# EAGLE design sensor_003 (EAGLE 4.16)
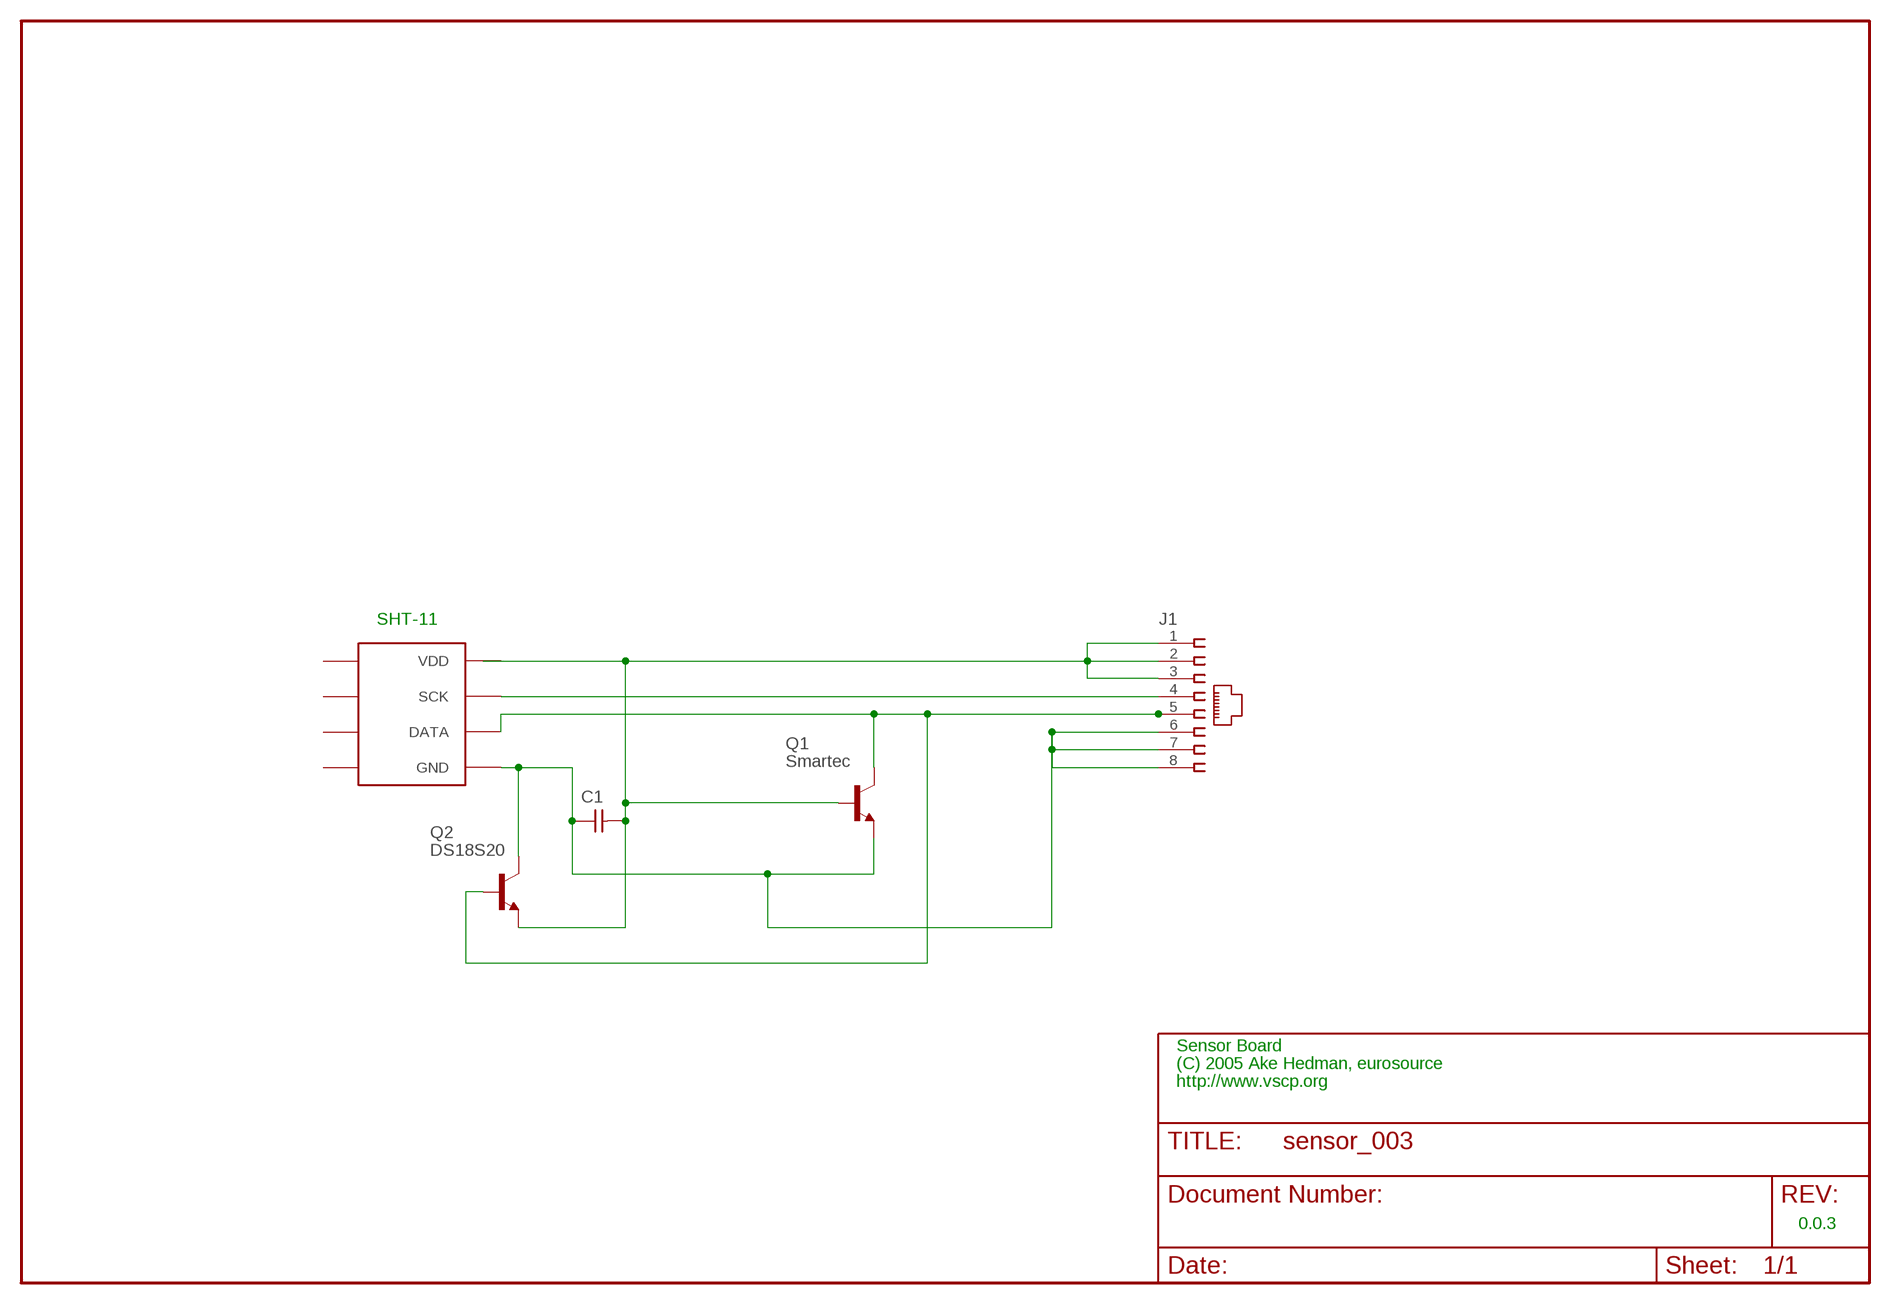
[diagram p0: schematic, sheet 1]

## Parts
C1  CAPNP-5  [C-5]
J1  215877-4  [215877-4]
Q1  Smartec  BC548  [TO92-EBC]
Q2  DS18S20  BC548  [TO92-EBC]
SHT1  SHT11  [SHT11]

## Nets
GND: C1.1 J1.6 J1.7 J1.8 Q1.E Q2.C SHT1.GND
N$4: J1.5 Q1.C Q2.B SHT1.DATA
SCK: J1.4 SHT1.SCK
VDD: C1.2 J1.1 J1.2 J1.3 Q1.B Q2.E
Unconnected: SHT1.5 SHT1.6 SHT1.7 SHT1.8

## Notes on the sheet
- SHT-11
- Sensor Board
- (C) 2005 Ake Hedman, eurosource
- http://www.vscp.org
- 0.0.3

## Power pins joined to a net without a drawn wire
VDD: SHT1.VDD

## Library data of the parts
C1 = discrete:CAPNP-5
J1 = con-amp:215877-4: AMP connector
Q1 Q2 = transistor-npn:BC548*: NPN Transistor
SHT1 = sht11:SHT11

## Board
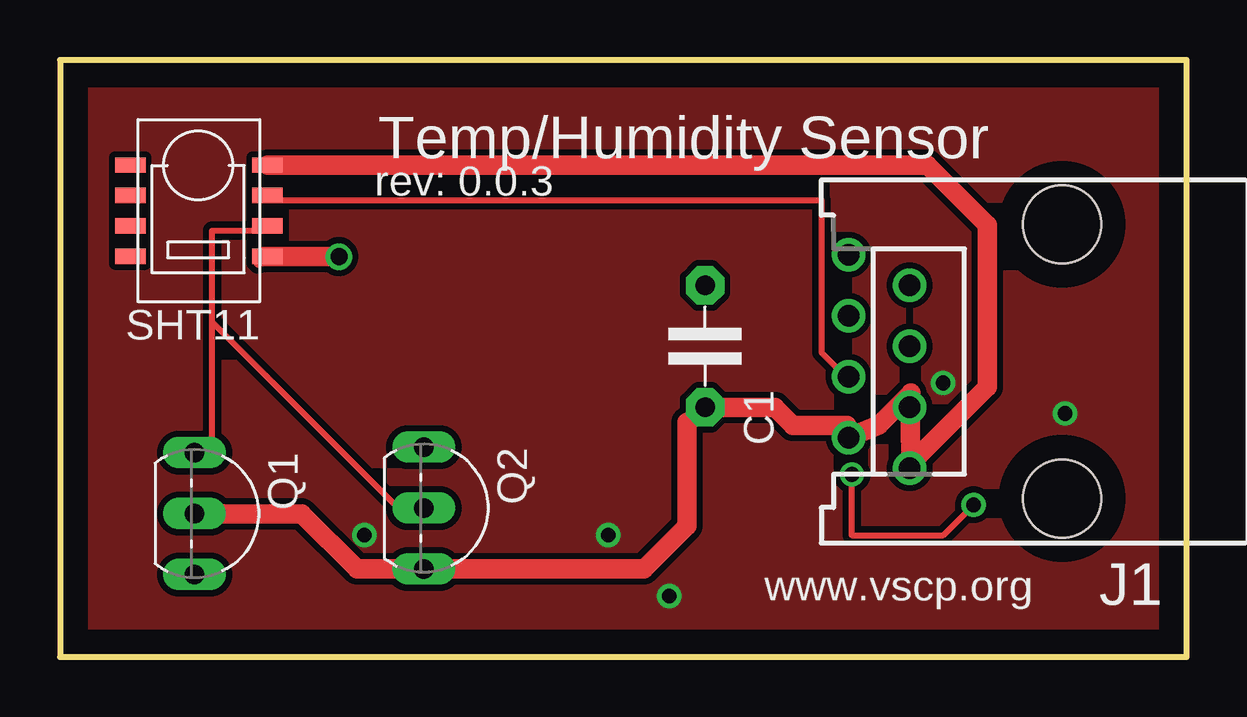
[diagram p1: board, top side]
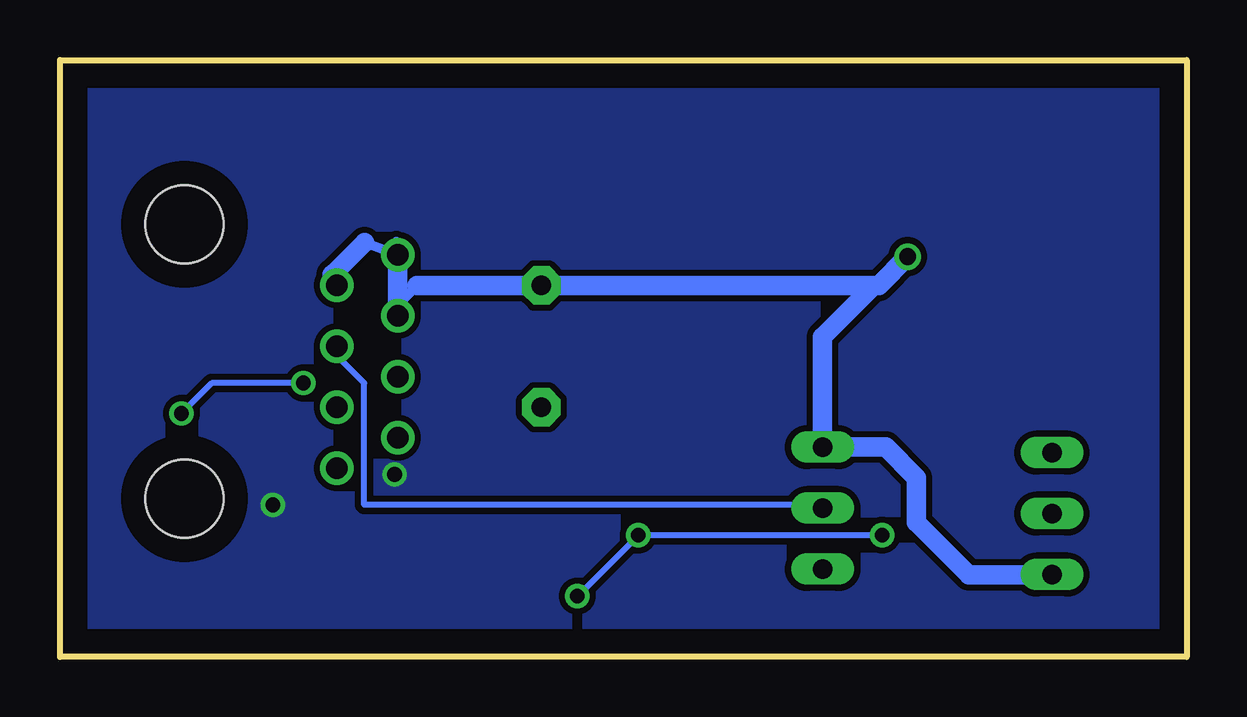
[diagram p2: board, bottom side, seen from below]

Size 46.96 x 24.89 mm. Coordinates in mm from the lower left corner, seen from the top.
Outline: 0,0 46.96,0 46.96,24.89 0,24.89 0,0
Copper layers (1*16): Top 0.035mm / dielectric 1.5mm / Bottom 0.035mm
Design rules "10mils": minimum track width 10mil, minimum drill 24mil, track to track 10mil, track to pad 10mil, pad to pad 10mil, via to via 10mil, smd to smd 10mil, copper to edge 40mil, drill to drill 10mil, minimum pad ring 10mil, minimum via ring 8mil, stop-mask expansion 0mil, vias tented up to drill 0mil, thermal gap 10mil

### Footprints (pad centres in the part's own frame; a part is rotated, then mirrored left to right if it is on the bottom)
C-5 = drill 0.813 pad 1.6 octagon: 1 -2.54,0; 2 2.54,0
215877-4 = drill 0.889 round: 1 -4.445,6.35; 2 -3.175,8.89; 3 -1.905,6.35; 4 -0.635,8.89; 5 0.635,6.35; 6 1.905,8.89; 7 3.175,6.35; 8 4.445,8.89 | hole 3.251: -5.715,0; 5.715,0
TO92-EBC = drill 0.813 long: B 0,-1.27; C -2.54,-1.27; E 2.54,-1.27
SHT11 = smd 1.27 x 0.635: 5 7.31,2.54; 6 7.31,3.81; 7 7.31,5.08; 8 7.31,6.35; DATA 1.59,5.08; GND 1.59,6.35; SCK 1.59,3.81; VDD 1.59,2.54

### Placement (x,y rotation side)
C1  26.89,12.95 270 top
J1  41.77,12.32 90 top
Q1  6.88,5.98 270 top
Q2  16.44,6.21 270 top
SHT1  10.24,23.05 180 top

### Tracks (layer width: path | path; a pad name or v marks a point on that pad's centre or on a via)
GND  (via drill 0.7)
  Top 0.406: SHT1.GND 8.53,16.7 8.52,16.69 8.27,16.44
  Top 0.813: v11.63,16.69 8.52,16.69
  Bottom 0.406: J1.6 32.93,14.63 32.07,15.49 | 32.93,17.31 J1.8 34.27,17.29 | 35.54,16.01 J1.7 | 13.07,15.44 13.07,15.49 | 5.32,3.44 5.28,3.48 | Q1.E 5.32,3.44 | 5.32,3.44 5.34,3.42
  Bottom 0.813: 32.07,15.49 C1.1 13.07,15.49 12.83,15.49 v11.63,16.69 | J1.6 J1.8 | 35.61,15.94 35.54,16.01 34.27,17.29 | 13.07,15.44 15.17,13.34 Q2.C 12.54,8.75 11.26,7.47 11.26,5.6 9.08,3.42 5.34,3.42
N$1  (via drill 0.61)
  Top 0.254: v38.09,6.34 36.82,5.07 33.01,5.07 v33.01,7.61
  pour Bottom (isolate 0.254): 0.8,23.99 0.8,0.99 0.99,0.8 45.79,0.8 46.04,1.05 46.04,23.92 1.11,23.92 0.8,23.61
N$2  (via drill 0.61)
  Bottom 0.254: v25.39,2.53 v22.85,5.07 v12.69,5.07 | v41.9,10.15 40.63,11.42 v36.82,11.42
  pour Top (isolate 0.254): 0.99,23.8 0.99,1.54 1.42,1.11 46.05,1.11 46.11,1.05 46.11,23.86 0.67,23.86 0.61,23.8
N$4
  Top 0.254: 6.34,13.96 6.34,8.88 Q1.C | 6.34,13.96 6.34,17.77 8.88,17.77 SHT1.DATA | 6.34,13.96 13.96,6.34 Q2.B
  Bottom 0.254: J1.5 35.55,12.69 34.28,11.42 34.28,6.34 15.23,6.34 Q2.B
SCK
  Top 0.254: SHT1.SCK 8.88,19.04 31.74,19.04 31.74,12.69 33.01,11.42 J1.4
VDD
  Top 0.406: 5.47,5.98 5.35,6.1 | Q1.B 5.47,5.98 | 5.47,5.98 5.48,5.97 | C1.2 26.89,10.52 26.14,9.77 | J1.2 32.91,9.67 32.87,9.71 32.81,9.65 | 35.55,11.08 35.47,11 J1.3 | 35.5,8.39 35.61,8.28 | 35.5,8.39 J1.1 35.8,8.39 | 35.47,8.42 35.5,8.39
  Top 0.813: 5.48,5.97 10.08,5.97 12.38,3.67 Q2.E 24.34,3.67 26.14,5.47 26.14,9.77 | C1.2 29.8,10.41 30.56,9.65 32.81,9.65 | J1.2 34.14,9.67 35.47,11 | J1.3 35.47,8.42 | SHT1.VDD 36.15,20.51 38.66,18 38.66,11.26 35.8,8.39

### Text on the board
tNames: Temp/Humidity Sensor | rev: 0.0.3 | www.vscp.org